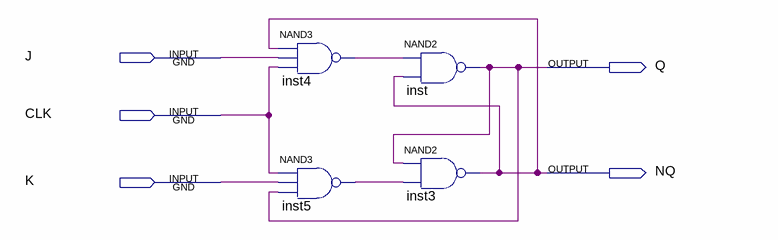
[diagram p0: schematic sheet]
// Quartus schematic JK_flip_flop.bdf as structural Verilog: 4 symbols, 5 pins
module JK_flip_flop (
  input  J,
  input  CLK,
  input  K,
  output Q,
  output NQ
);

  wire inst4_out, inst5_out;

  nand inst4 (inst4_out, NQ, J, CLK);
  nand inst5 (inst5_out, CLK, K, Q);
  nand inst (Q, inst4_out, NQ);
  nand inst3 (NQ, Q, inst5_out);
endmodule
